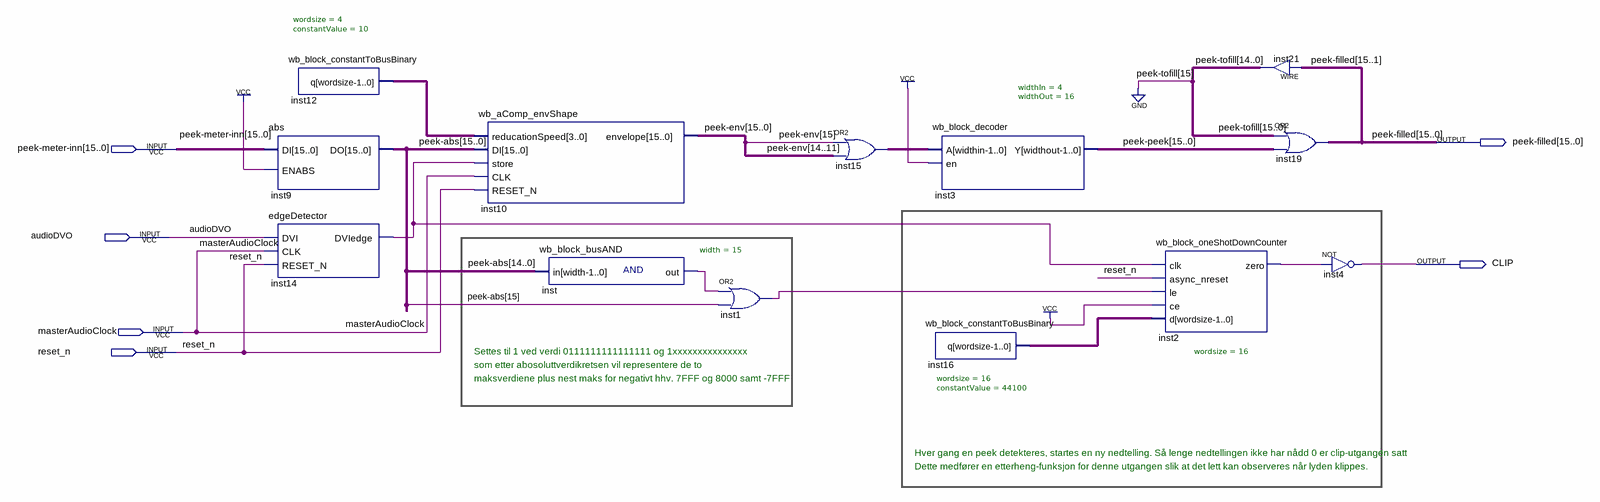
[diagram p0: schematic sheet]
// Quartus schematic wb_audio_peekmeter.bdf as structural Verilog: 13 symbols, 6 pins
module wb_audio_peekmeter (
  input  [15:0] \peek-meter-inn ,
  input  audioDVO,
  input  masterAudioClock,
  input  reset_n,
  output [15:0] \peek-filled ,
  output CLIP
);

  wire inst1_out, inst2_zero, inst14_dviedge, inst_out;
  wire [3:0] inst12_q, inst15_out;
  wire [14:0] \peek-tofill ;
  wire [15:0] inst16_q, \peek-abs , \peek-env , \peek-peek ;

  wb_block_constantToBusBinary #(.wordsize(4), .constantValue(10)) inst12 (.q(inst12_q));
  abs inst9 (.ENABS(1'b1), .DI(\peek-meter-inn ), .DO(\peek-abs ));
  edgeDetector inst14 (.DVI(audioDVO), .CLK(masterAudioClock), .RESET_N(reset_n), .DVIedge(inst14_dviedge));
  wb_aComp_envShape inst10 (
    .reducationSpeed(inst12_q), .DI(\peek-abs ), .CLK(masterAudioClock), .store(inst14_dviedge),
    .RESET_N(reset_n), .envelope(\peek-env ));
  wb_block_busAND #(.width(15)) inst (.in(\peek-abs [14:0]), .out(inst_out));
  or inst1 (inst1_out, inst_out, \peek-abs [15]);
  assign inst15_out = {4{\peek-env [15]}} | \peek-env [14:11];  // OR2 inst15, 4 bits wide
  wb_block_decoder #(.widthIn(4), .widthOut(16)) inst3 (.A(inst15_out), .en(1'b1), .Y(\peek-peek ));
  wb_block_constantToBusBinary #(.wordsize(16), .constantValue(44100)) inst16 (.q(inst16_q));
  wb_block_oneShotDownCounter #(.wordsize(16)) inst2 (
    .clk(inst14_dviedge), .async_nreset(reset_n), .le(inst1_out), .ce(1'b1), .d(inst16_q), .zero(inst2_zero));
  assign \peek-tofill  = \peek-filled [15:1];  // WIRE inst21
  assign \peek-filled  = {1'b0, \peek-tofill } | \peek-peek ;  // OR2 inst19, 16 bits wide
  not inst4 (CLIP, inst2_zero);

  // Notes on the sheet:
  //   Settes til 1 ved verdi 0111111111111111 og 1xxxxxxxxxxxxxxx
  //   som etter abosoluttverdikretsen vil representere de to
  //   maksverdiene plus nest maks for negativt hhv. 7FFF og 8000 samt -7FFF
  //   Hver gang en peek detekteres, startes en ny nedtelling. Så lenge nedtellingen ikke har nådd 0 er clip-utgangen satt
  //   Dette medfører en etterheng-funksjon for denne utgangen slik at det lett kan observeres når lyden klippes.
endmodule
